# EAGLE design Pcb desigin (EAGLE 9.5.2)
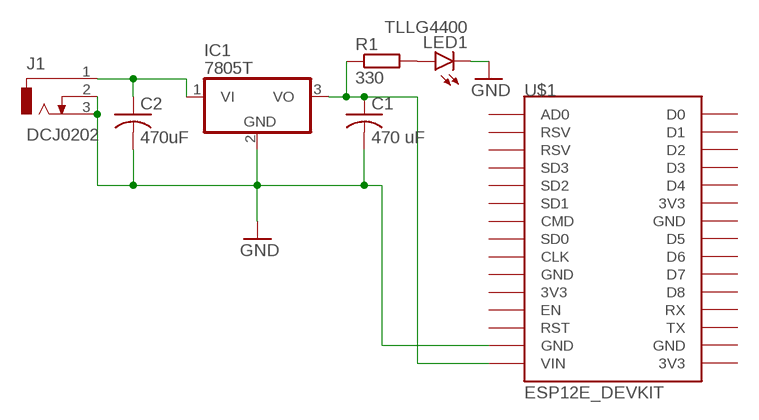
[diagram p0: schematic, sheet 1]

## Parts
C1  470 uF  C-US025-025X050  [C025-025X050]
C2  470uF  C-US025-025X050  [C025-025X050]
IC1  7805T  [TO220H]
J1  DCJ0202  [DCJ0202]
LED1  TLLG4400  [LED3MM]
R1  330  R-EU_RDH/15  [RDH/15]
U$1  ESP12E_DEVKIT  [ESP12E_DEVKIT]

## Nets
GND: C1.2 C2.2 IC1.2(GND) J1.2 J1.3 LED1.K(C) U$1.GND@1(GND)
N$1: LED1.A R1.2
N$2: C2.1 IC1.1(VI) J1.1
N$3: C1.1 IC1.3(VO) R1.1 U$1.VIN
Unconnected: U$1.3V3@0(3V3) U$1.3V3@1(3V3) U$1.3V3@2(3V3) U$1.AD0 U$1.CLK U$1.CMD U$1.D0 U$1.D1 U$1.D2 U$1.D3 U$1.D4 U$1.D5 U$1.D6 U$1.D7 U$1.D8 U$1.EN U$1.GND@0(GND) U$1.GND@2(GND) U$1.GND@3(GND) U$1.RST U$1.RSV@0(RSV) U$1.RSV@1(RSV) U$1.RX U$1.SD0 U$1.SD1 U$1.SD2 U$1.SD3 U$1.TX

## Library data of the parts
C1 C2 = rcl:C-US: CAPACITOR, American symbol; SPICEPREFIX: C
IC1 = linear:78*: Positive VOLTAGE REGULATOR Source: http://cache.national.com/ds/LM/LM78L05.pdf http://www.fairchildsemi.com/ds/LM/LM7805.pdf
J1 = con-jack:DCJ0202: DC POWER JACK Source: DCJ0202.pdf; OC_FARNELL: unknown; OC_NEWARK: unknown
LED1 = led:TLLG4400: Low Current (2mA) LED 3 mm Tinted Diffused Package color GREEN Source: Data sheet <http://www.farnell.com/datasheets/391098.pdf>; MF: VISHAY SEMICONDUCTOR; OC_FARNELL: 1612435
R1 = rcl:R-EU_: RESISTOR, European symbol; SPICEPREFIX: R
U$1 = ESP12E_DEVKIT:ESP12E_DEVKIT: ESP12E DEVKIT BOARD

## Board
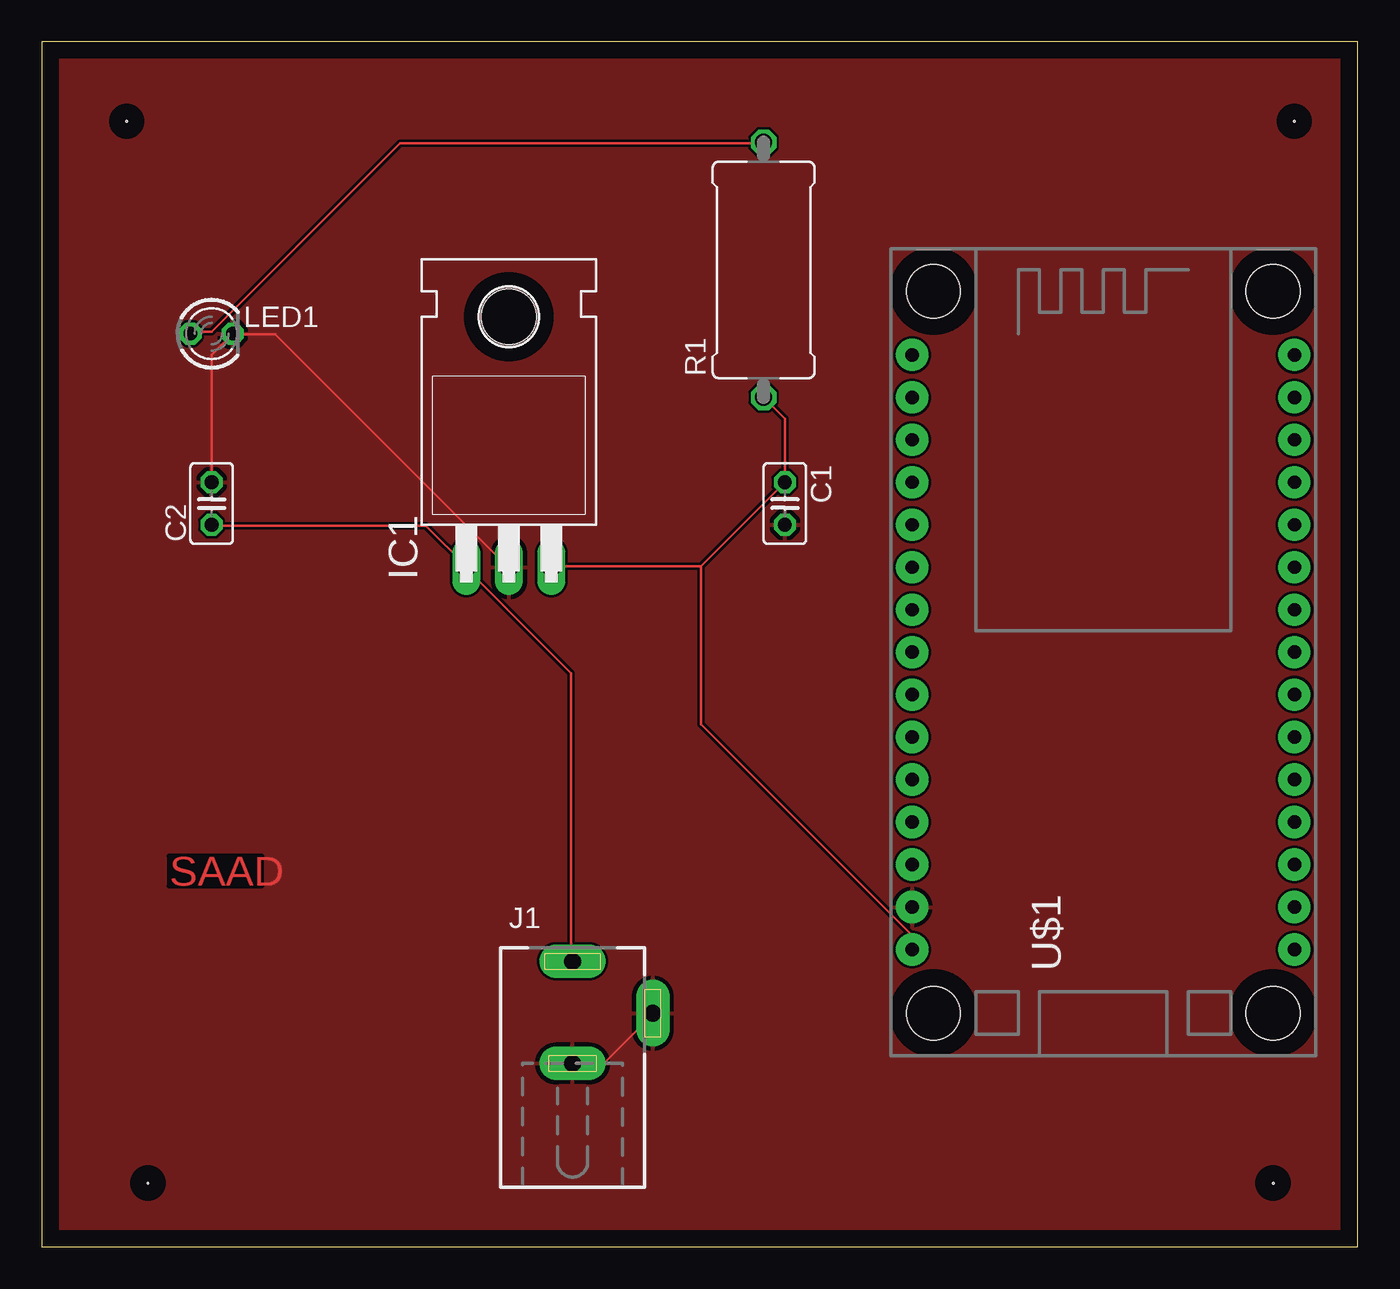
[diagram p1: board, top side]
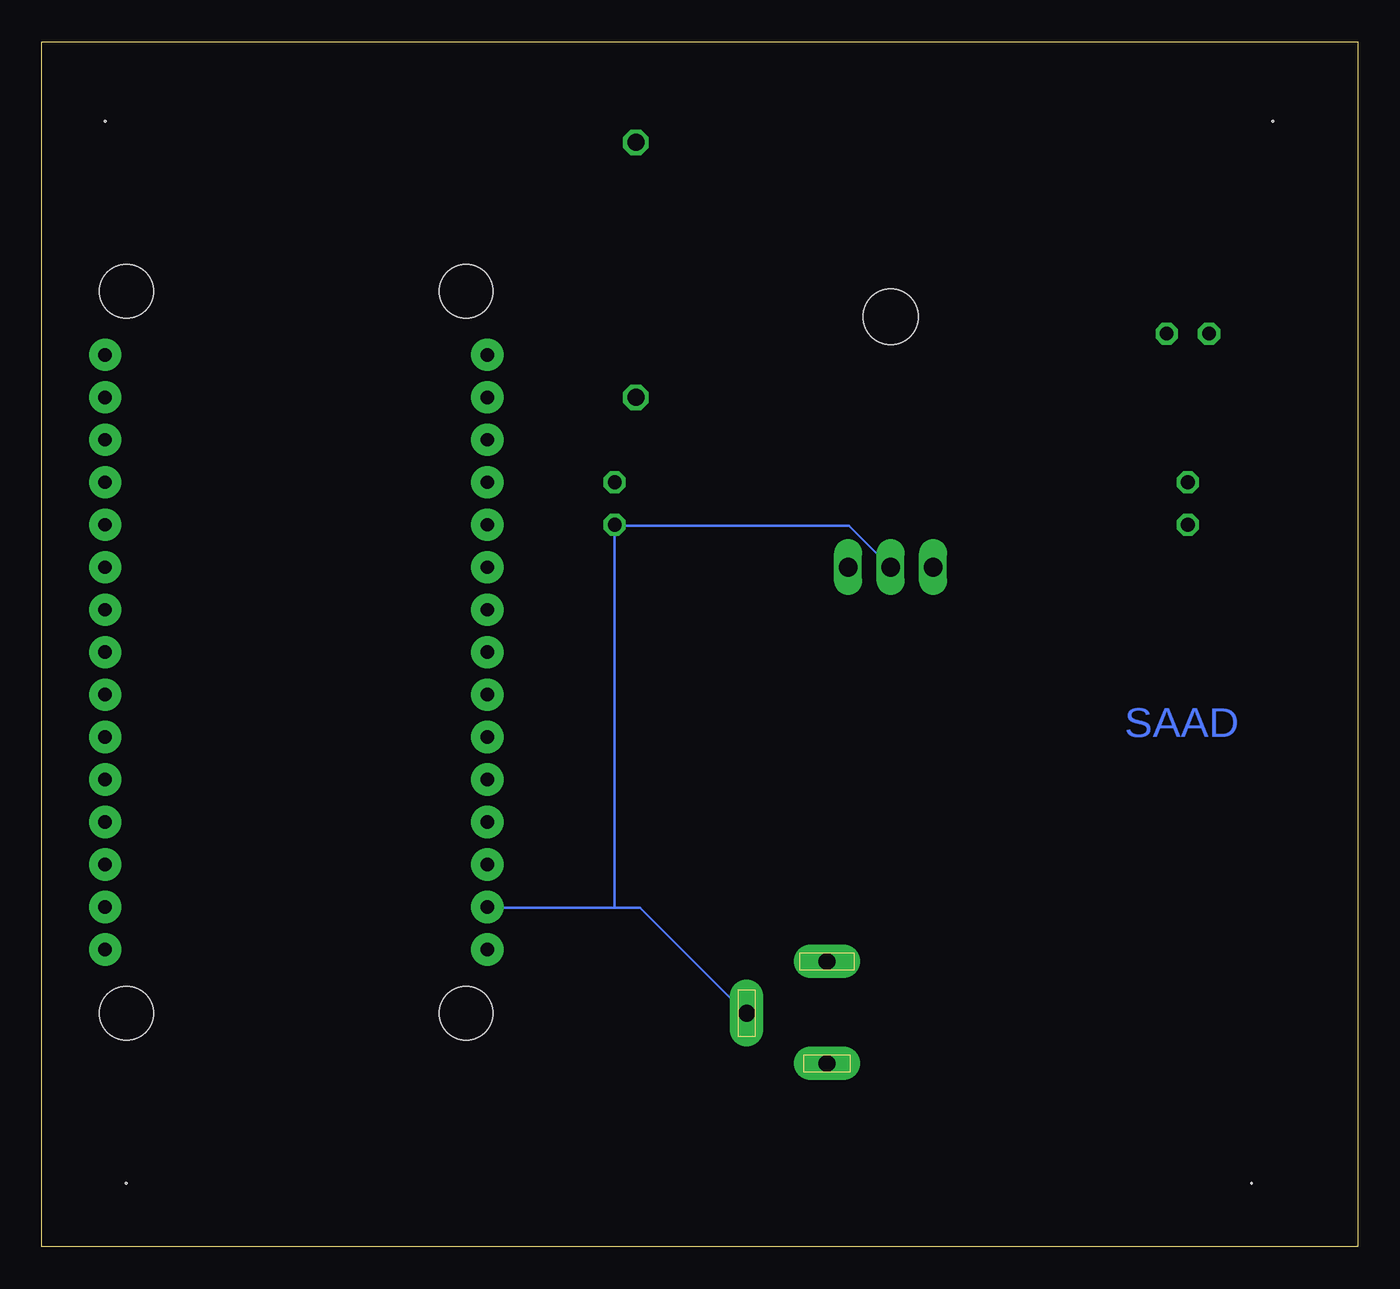
[diagram p2: board, bottom side, seen from below]

Size 78.72 x 72.06 mm. Coordinates in mm from the lower left corner, seen from the top.
Outline: 0,0 78.72,0 78.72,72.06 0,72.06 0,0
Copper layers (1*16): Top 0.035mm / dielectric 1.5mm / Bottom 0.035mm
Design rules "default": minimum track width 6mil, minimum drill 0.35mm, track to track 6mil, track to pad 6mil, pad to pad 6mil, via to via 6mil, smd to smd 6mil, copper to edge 40mil, drill to drill 6mil, minimum pad ring 10mil, minimum via ring 8mil, stop-mask expansion 4mil, vias tented up to drill 0mil, thermal gap 10mil
Holes 0.08 mm at 74.93,67.31 73.66,3.81 6.35,3.81 5.08,67.31

### Footprints (pad centres in the part's own frame; a part is rotated, then mirrored left to right if it is on the bottom)
C025-025X050 = drill 0.813 octagon: 1 -1.27,0; 2 1.27,0
TO220H = drill 1.118 long: 1 -2.54,-10.16; 2 0,-10.16; 3 2.54,-10.16 | hole 3.302: 0,4.826
DCJ0202 = drill 1 pad 2 long: 1 0,3.1; 2 4.8,0; 3 0,-3
LED3MM = drill 0.813 octagon: A -1.27,0; K 1.27,0
RDH/15 = drill 1.016 octagon: 1 -7.62,0; 2 7.62,0
ESP12E_DEVKIT = drill 0.8 pad 1.93: 3V3@0 -11.43,-7.62; 3V3@1 11.43,5.08; 3V3@2 11.43,-17.78; AD0 -11.43,17.78; CLK -11.43,-2.54; CMD -11.43,2.54; D0 11.43,17.78; D1 11.43,15.24; D2 11.43,12.7; D3 11.43,10.16; D4 11.43,7.62; D5 11.43,0; D6 11.43,-2.54; D7 11.43,-5.08; D8 11.43,-7.62; EN -11.43,-10.16; GND@0 -11.43,-5.08; GND@1 -11.43,-15.24; GND@2 11.43,2.54; GND@3 11.43,-15.24; RST -11.43,-12.7; RSV@0 -11.43,15.24; RSV@1 -11.43,12.7; RX 11.43,-10.16; SD0 -11.43,0; SD1 -11.43,5.08; SD2 -11.43,7.62; SD3 -11.43,10.16; TX 11.43,-12.7; VIN -11.43,-17.78 | hole 3.2: -10.16,21.59; 10.16,21.59; 10.16,-21.59; -10.16,-21.59

### Placement (x,y rotation side)
C1  44.45,44.45 270 top
C2  10.16,44.45 90 top
IC1  27.94,50.8 0 top
J1  31.75,13.97 0 top
LED1  10.16,54.61 0 top
R1  43.18,58.42 90 top
U$1  63.5,35.56 0 top

### Tracks (layer width: path | path; a pad name or v marks a point on that pad's centre or on a via)
GND
  Top 0.152: J1.3 31.8,10.97 33.63,10.97 36.53,13.87 J1.2 | C2.2 10.16,53.34 LED1.K 11.53,54.56 13.97,54.56 27.84,40.69 IC1.2
  Bottom 0.152: 44.45,20.27 42.93,20.27 36.68,14.02 J1.2 | 44.45,20.27 52.07,20.27 U$1.GND@1 | 44.45,43.13 30.43,43.13 IC1.2 | 44.45,43.13 44.45,20.27 | 44.45,43.13 C1.2
  pour Top (isolate 0.008): 0,72.39 78.74,72.39 78.74,0 0,0
N$1
  Top 0.152: LED1.A 8.94,54.71 10.16,54.71 21.44,65.99 43.08,65.99 R1.2
N$2
  Top 0.152: C2.1 10.16,43.13 22.96,43.13 25.4,40.69 IC1.1 25.4,40.54 31.65,34.29 31.65,17.22 J1.1
N$3
  Top 0.152: R1.1 44.45,49.53 C1.1 39.42,40.69 | 39.42,40.69 30.58,40.69 IC1.3 | U$1.VIN 52.07,18.59 39.42,31.24 39.42,40.69

### Text on the board
Top: SAAD
Bottom: SAAD